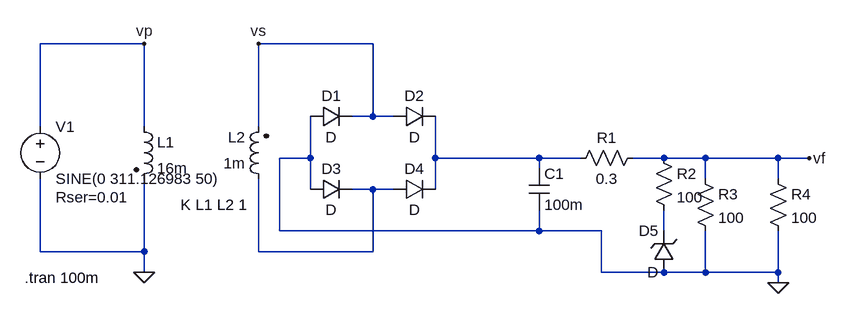
[diagram p0: schematic bridge.asc]
bridge.asc, the LTspice schematic file:
Version 4
SHEET 1 904 680
WIRE -160 -16 -320 -16
WIRE 192 -16 16 -16
WIRE 192 96 192 -16
WIRE 192 96 160 96
WIRE 224 96 192 96
WIRE -320 112 -320 -16
WIRE -160 112 -160 -16
WIRE 16 112 16 -16
WIRE 96 160 96 96
WIRE 96 160 48 160
WIRE 288 160 288 96
WIRE 448 160 288 160
WIRE 512 160 448 160
WIRE 640 160 592 160
WIRE 704 160 640 160
WIRE 816 160 704 160
WIRE 864 160 816 160
WIRE 448 176 448 160
WIRE 704 192 704 160
WIRE 816 192 816 160
WIRE 96 208 96 160
WIRE 192 208 160 208
WIRE 224 208 192 208
WIRE 288 208 288 160
WIRE 48 272 48 160
WIRE 448 272 448 240
WIRE 448 272 48 272
WIRE 544 272 448 272
WIRE 640 272 640 240
WIRE -320 304 -320 192
WIRE -160 304 -160 192
WIRE -160 304 -320 304
WIRE 16 304 16 192
WIRE 192 304 192 208
WIRE 192 304 16 304
WIRE -160 336 -160 304
WIRE 544 336 544 272
WIRE 640 336 544 336
WIRE 704 336 704 272
WIRE 704 336 640 336
WIRE 816 336 816 272
WIRE 816 336 704 336
WIRE 816 352 816 336
FLAG -160 336 0
FLAG -160 -16 vp
FLAG 16 -16 vs
FLAG 816 352 0
FLAG 864 160 vf
SYMBOL diode 96 112 R270
WINDOW 0 32 32 VTop 2
WINDOW 3 0 32 VBottom 2
SYMATTR InstName D1
SYMBOL diode 96 224 R270
WINDOW 0 32 32 VTop 2
WINDOW 3 0 32 VBottom 2
SYMATTR InstName D3
SYMBOL voltage -320 96 R0
WINDOW 123 0 0 Left 0
WINDOW 39 24 124 Left 2
SYMATTR SpiceLine Rser=0.01
SYMATTR InstName V1
SYMATTR Value SINE(0 311.126983 50)
SYMBOL diode 224 224 R270
WINDOW 0 32 32 VTop 2
WINDOW 3 0 32 VBottom 2
SYMATTR InstName D4
SYMBOL diode 224 112 R270
WINDOW 0 32 32 VTop 2
WINDOW 3 0 32 VBottom 2
SYMATTR InstName D2
SYMBOL ind2 -176 96 R0
SYMATTR InstName L1
SYMATTR Value 16m
SYMATTR Type ind
SYMBOL ind2 32 208 R180
WINDOW 0 36 80 Left 2
WINDOW 3 36 40 Left 2
SYMATTR InstName L2
SYMATTR Value 1m
SYMATTR Type ind
SYMBOL res 624 144 R0
SYMATTR InstName R2
SYMATTR Value 100
SYMBOL zener 656 336 R180
WINDOW 0 24 64 Left 2
WINDOW 3 24 0 Left 2
SYMATTR InstName D5
SYMBOL res 688 176 R0
SYMATTR InstName R3
SYMATTR Value 100
SYMBOL res 800 176 R0
SYMATTR InstName R4
SYMATTR Value 100
SYMBOL res 608 144 R90
WINDOW 0 0 56 VBottom 2
WINDOW 3 32 56 VTop 2
SYMATTR InstName R1
SYMATTR Value 0.3
SYMBOL cap 432 176 R0
SYMATTR InstName C1
SYMATTR Value 100m
TEXT -344 344 Left 2 !.tran 100m
TEXT -104 232 Left 2 !K L1 L2 1

The netlist it stands for:
* bridge.asc
D1 0 vs D
D3 0 N002 D
V1 vp 0 SINE(0 311.126983 50) Rser=0.01
D4 N002 N001 D
D2 vs N001 D
L1 vp 0 16m
L2 N002 vs 1m
R2 vf N003 100
D5 0 N003 D
R3 vf 0 100
R4 vf 0 100
R1 vf N001 0.3
C1 N001 0 100m
.model D D
.lib standard.dio
.tran 100m
K L1 L2 1
.backanno
.end